# Altium schematic sheet Power3V3.SchDoc
size 214 x 111 mm; SheetNumber: 1; SheetTotal: 1
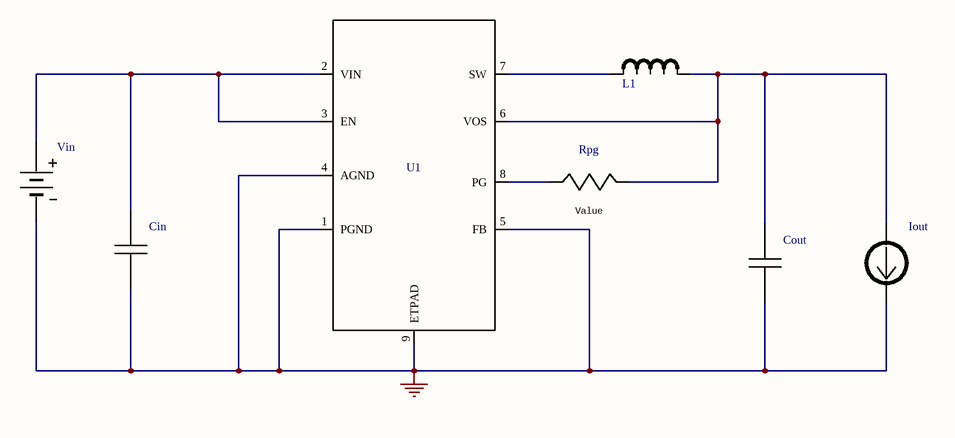
[diagram p0: Power3V3.SchDoc]

## Parts
Cin  GRM219R61E106KA1  [0805]  (value not drawn)
Cout  GRM31CR70J226KE1  [1206]  (value not drawn)
Iout  WB_CURRENT_LOAD  (value not drawn)
L1  VLF252015MT-2R2M  [VLF252015MT]  (value not drawn)
Rpg  CRCW0402100KFKED  [0402]  (value not drawn)
U1  TPS62172DSGR  [S-PWSON-N8]  (value not drawn)
Vin  WB_BATTERY  (value not drawn)

## Nets
0: Cin.2 Cout.2 Iout.2(-) U1.1(PGND) U1.4(AGND) U1.5(FB) U1.9(ETPAD) Vin.2(-)
NetCin_1: Cin.1 U1.2(VIN) U1.3(EN) Vin.1(+)
NetCout_1: Cout.1 Iout.1(+) L1.1 Rpg.1 U1.6(VOS)
NetL1_2: L1.2 U1.7(SW)
NetRpg_2: Rpg.2 U1.8(PG)

## Library data of the parts
Cin = GRM219R61E106KA1: Imported; Manufacturer_Part_Number: GRM219R61E106KA12; Manufacturer_Name: MuRata; Vendor: Nichicon; Value: Value; RefDes: RefDes; TYPE: TYPE
Cout = GRM31CR70J226KE1: Imported; Manufacturer_Part_Number: GRM31CR70J226KE19L; Vendor: MuRata; Value: Value; Manufacturer_Name: MuRata; RefDes: RefDes; TYPE: TYPE
Iout = WB_CURRENT_LOAD: Imported; PowerPortType: POWER_GROUND; Value: Value; Manufacturer_Part_Number: WB_CURRENT_LOAD; Manufacturer_Name: WB_CURRENT_LOAD; RefDes: RefDes; TYPE: TYPE
L1 = VLF252015MT-2R2M: Imported; Manufacturer_Part_Number: 'VLF252015MT-2R2M'; Manufacturer_Name: TDK; Vendor: Gimme a name; Value: Value
Rpg = CRCW0402100KFKED: Imported; Vendor: Vishay-Dale; Value: Value; Manufacturer_Part_Number: CRCW0402100KFKED; Manufacturer_Name: Vishay-Dale; RefDes: RefDes; TYPE: TYPE
U1 = TPS62172DSGR: Imported; Vendor: Texas Instruments; Value: Value; Manufacturer_Part_Number: TPS62172DSGR; Manufacturer_Name: Texas Instruments; RefDes: RefDes; TYPE: TYPE
Vin = WB_BATTERY: Imported; PowerPortType: POWER_GROUND; Value: Value; Manufacturer_Part_Number: WB_BATTERY; Manufacturer_Name: WB_BATTERY; RefDes: RefDes; TYPE: TYPE